# EasyEDA Pro project mega-sd-easyeda.eprj

# Schematic Schematic1
Board Name: Board1; Create Date: 2025-04-16; Page Name: P1; Project Name: mega-sd-easyeda; Schematic Name: Schematic1; Update Date: 2025-04-16; Company: EasyEDA.com; Page Size: A4; Version: V1.0
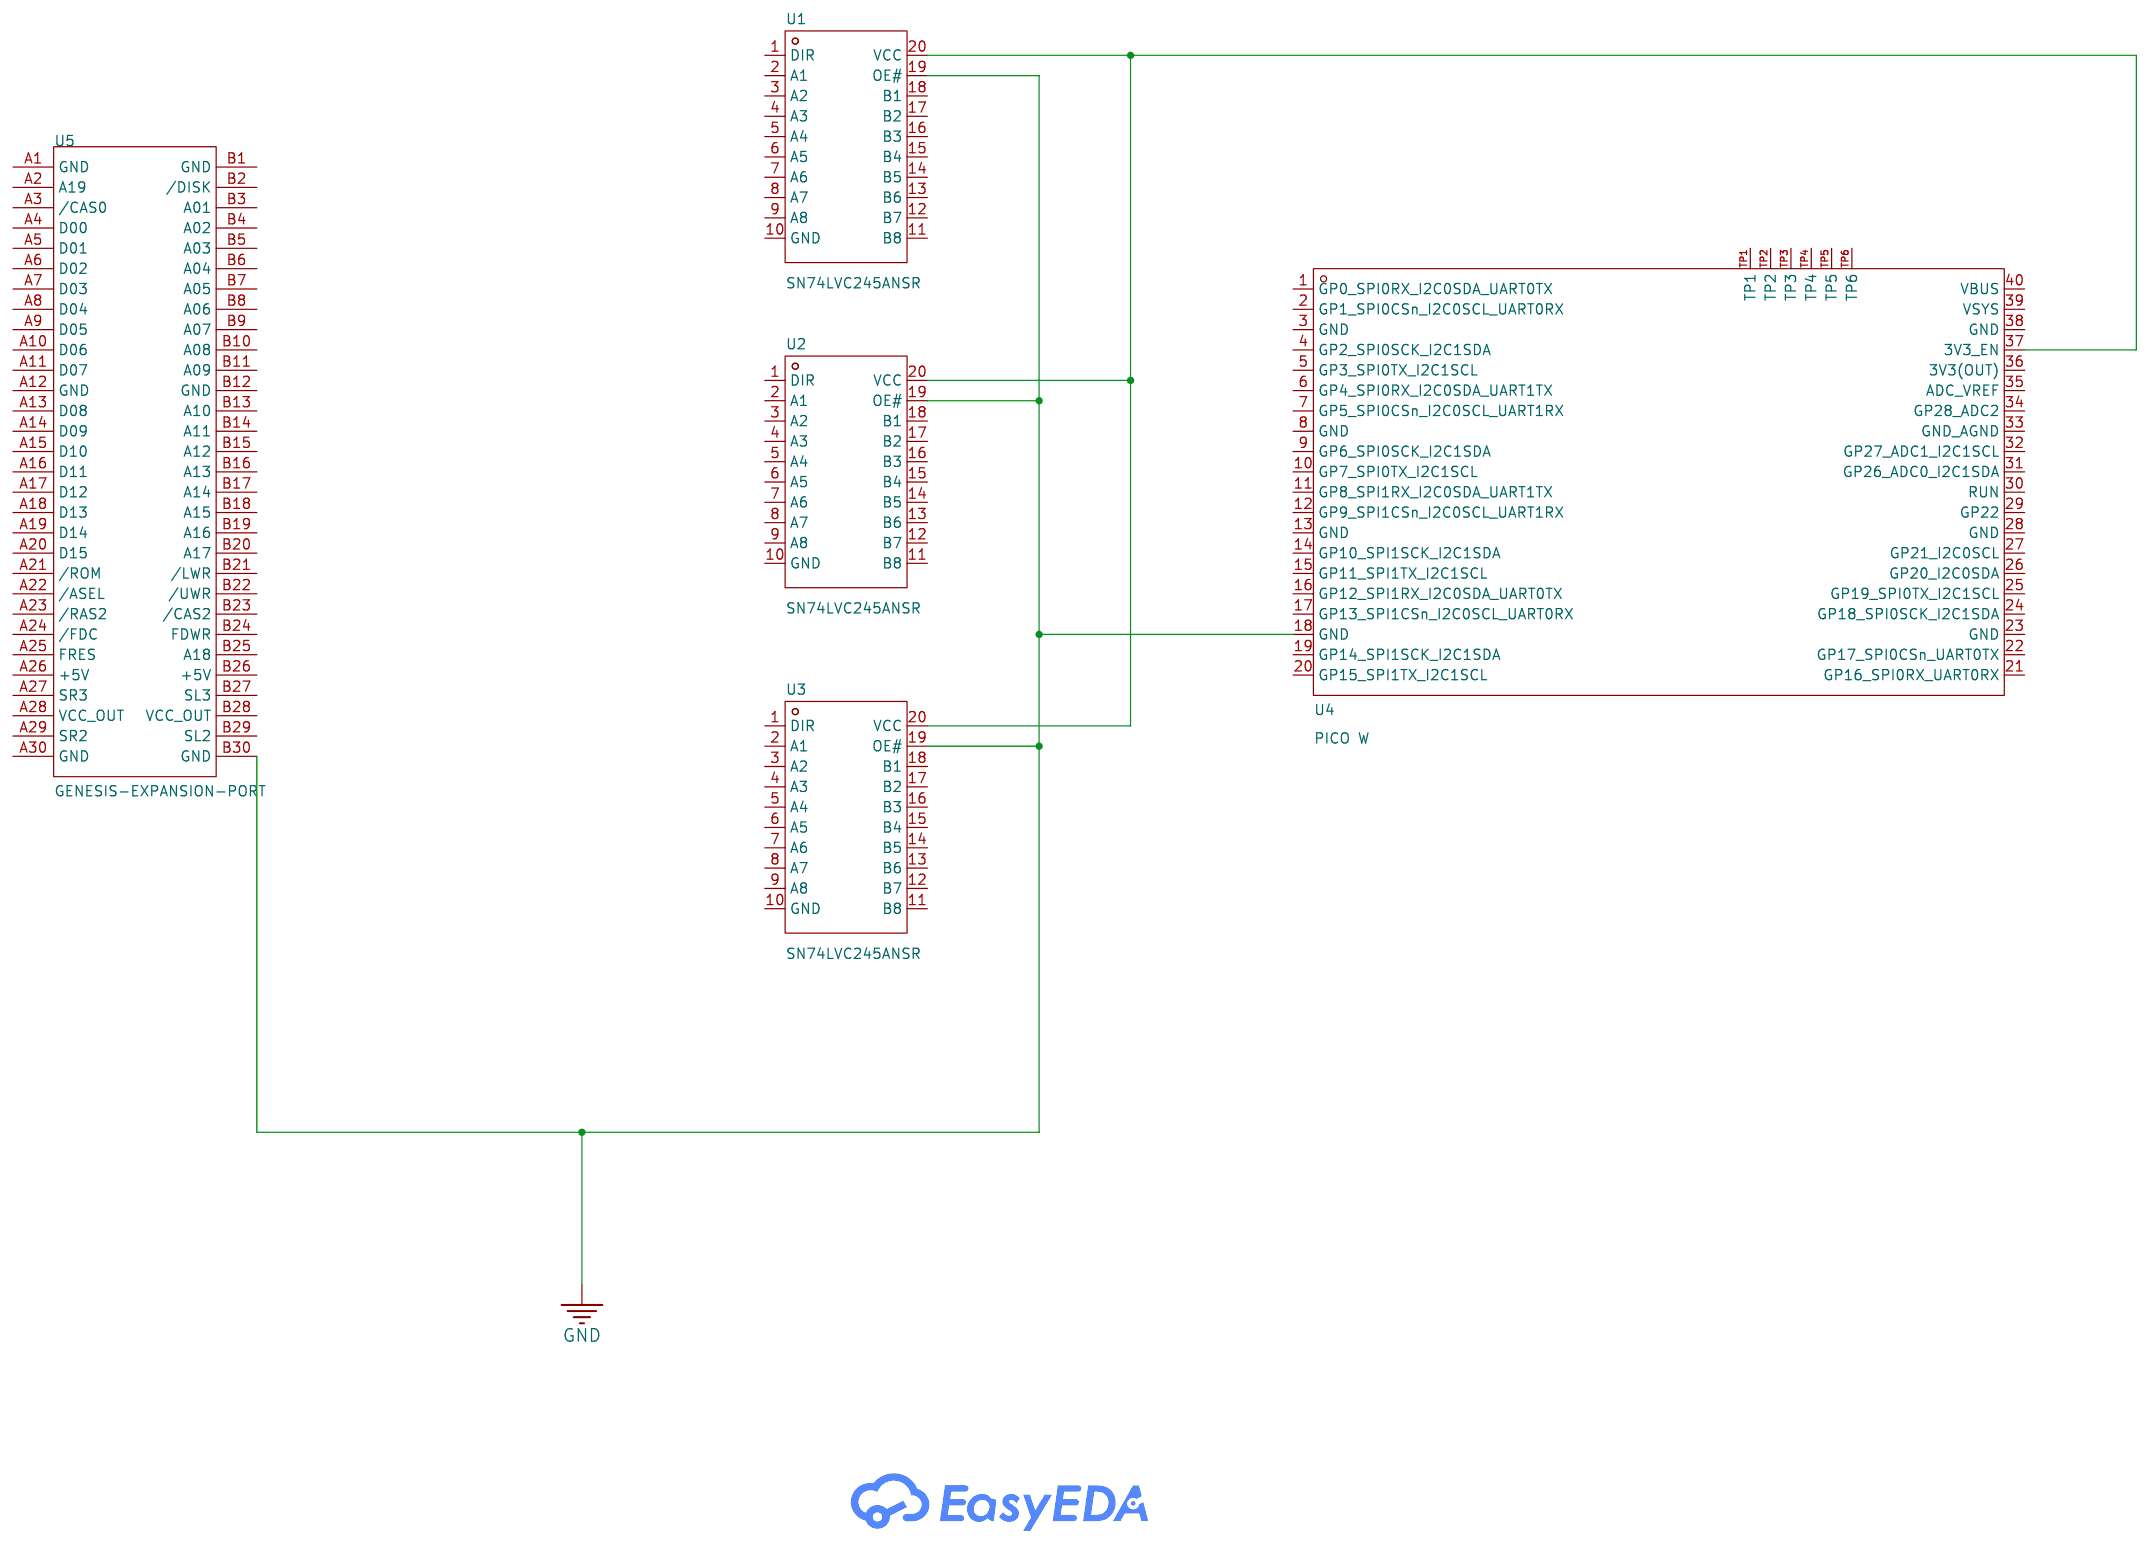
[diagram p0: schematic sheet]

## Parts
U1  SN74LVC245ANSR  [SOIC-20_L13.3-W5.5-P1.27-LS7.8-BL]
U2  SN74LVC245ANSR  [SOIC-20_L13.3-W5.5-P1.27-LS7.8-BL]
U3  SN74LVC245ANSR  [SOIC-20_L13.3-W5.5-P1.27-LS7.8-BL]
U4  PICO W  [COMM-SMD_L51.0-W21.0-P2.54_PICOW]
U5  GENESIS-EXPANSION-PORT  [GENESIS-EXPANSION-PORT]

## Library data of the parts
U1-U3 = SN74LVC245ANSR: Supplier Part: C15908; Manufacturer: TI(德州仪器); Supplier Footprint: SOIC-20-208mil; JLCPCB Part Class: Extended Part; Datasheet: https://www.ti.com/cn/lit/gpn/sn74lvc245a; Supplier: LCSC
U4 = PICO W: Supplier Part: C7203003; Manufacturer: Raspberry Pi(树莓派); JLCPCB Part Class: Extended Part; Datasheet: https://atta.szlcsc.com/upload/public/pdf/source/20230906/10B4C0665D815973E97A5F4971CA719F.pdf; Supplier: LCSC
U5 = GENESIS-EXPANSION-PORT

## Nets
GND: U1.19(OE#) U2.19(OE#) U3.19(OE#) U4.18(GND) U5.B30(GND)
Net-(U1-20): U1.20(VCC) U2.20(VCC) U3.20(VCC) U4.37(3V3_EN)

Not connected (* = marked no-connect by the designer): U1 1(DIR) 2(A1) 3(A2) 4(A3) 5(A4) 6(A5) 7(A6) 8(A7) 9(A8) 10(GND) 11(B8) 12(B7) 13(B6) 14(B5) 15(B4) 16(B3) 17(B2) 18(B1); U2 1(DIR) 2(A1) 3(A2) 4(A3) 5(A4) 6(A5) 7(A6) 8(A7) 9(A8) 10(GND) 11(B8) 12(B7) 13(B6) 14(B5) 15(B4) 16(B3) 17(B2) 18(B1); U3 1(DIR) 2(A1) 3(A2) 4(A3) 5(A4) 6(A5) 7(A6) 8(A7) 9(A8) 10(GND) 11(B8) 12(B7) 13(B6) 14(B5) 15(B4) 16(B3) 17(B2) 18(B1); U4 1(GP0_SPI0RX_I2C0SDA_UART0TX) 2(GP1_SPI0CSn_I2C0SCL_UART0RX) 3(GND) 4(GP2_SPI0SCK_I2C1SDA) 5(GP3_SPI0TX_I2C1SCL) 6(GP4_SPI0RX_I2C0SDA_UART1TX) 7(GP5_SPI0CSn_I2C0SCL_UART1RX) 8(GND) 9(GP6_SPI0SCK_I2C1SDA) 10(GP7_SPI0TX_I2C1SCL) 11(GP8_SPI1RX_I2C0SDA_UART1TX) 12(GP9_SPI1CSn_I2C0SCL_UART1RX) 13(GND) 14(GP10_SPI1SCK_I2C1SDA) 15(GP11_SPI1TX_I2C1SCL) 16(GP12_SPI1RX_I2C0SDA_UART0TX) 17(GP13_SPI1CSn_I2C0SCL_UART0RX) 19(GP14_SPI1SCK_I2C1SDA) 20(GP15_SPI1TX_I2C1SCL) 21(GP16_SPI0RX_UART0RX) 22(GP17_SPI0CSn_UART0TX) 23(GND) 24(GP18_SPI0SCK_I2C1SDA) 25(GP19_SPI0TX_I2C1SCL) 26(GP20_I2C0SDA) 27(GP21_I2C0SCL) 28(GND) 29(GP22) 30(RUN) 31(GP26_ADC0_I2C1SDA) 32(GP27_ADC1_I2C1SCL) 33(GND_AGND) 34(GP28_ADC2) 35(ADC_VREF) 36(3V3(OUT)) 38(GND) 39(VSYS) 40(VBUS) TP1 TP2 TP3 TP4 TP5 TP6; U5 A1(GND) A2(A19) A3(/CAS0) A4(D00) A5(D01) A6(D02) A7(D03) A8(D04) A9(D05) A10(D06) A11(D07) A12(GND) A13(D08) A14(D09) A15(D10) A16(D11) A17(D12) A18(D13) A19(D14) A20(D15) A21(/ROM) A22(/ASEL) A23(/RAS2) A24(/FDC) A25(FRES) A26(+5V) A27(SR3) A28(VCC OUT) A29(SR2) A30(GND) B1(GND) B2(/DISK) B3(A01) B4(A02) B5(A03) B6(A04) B7(A05) B8(A06) B9(A07) B10(A08) B11(A09) B12(GND) B13(A10) B14(A11) B15(A12) B16(A13) B17(A14) B18(A15) B19(A16) B20(A17) B21(/LWR) B22(/UWR) B23(/CAS2) B24(FDWR) B25(A18) B26(+5V) B27(SL3) B28(VCC OUT) B29(SL2)
